# Altium schematic sheet Comparator.SchDoc
size Letter; DocumentNumber: 3; SheetNumber: 3; SheetTotal: 7
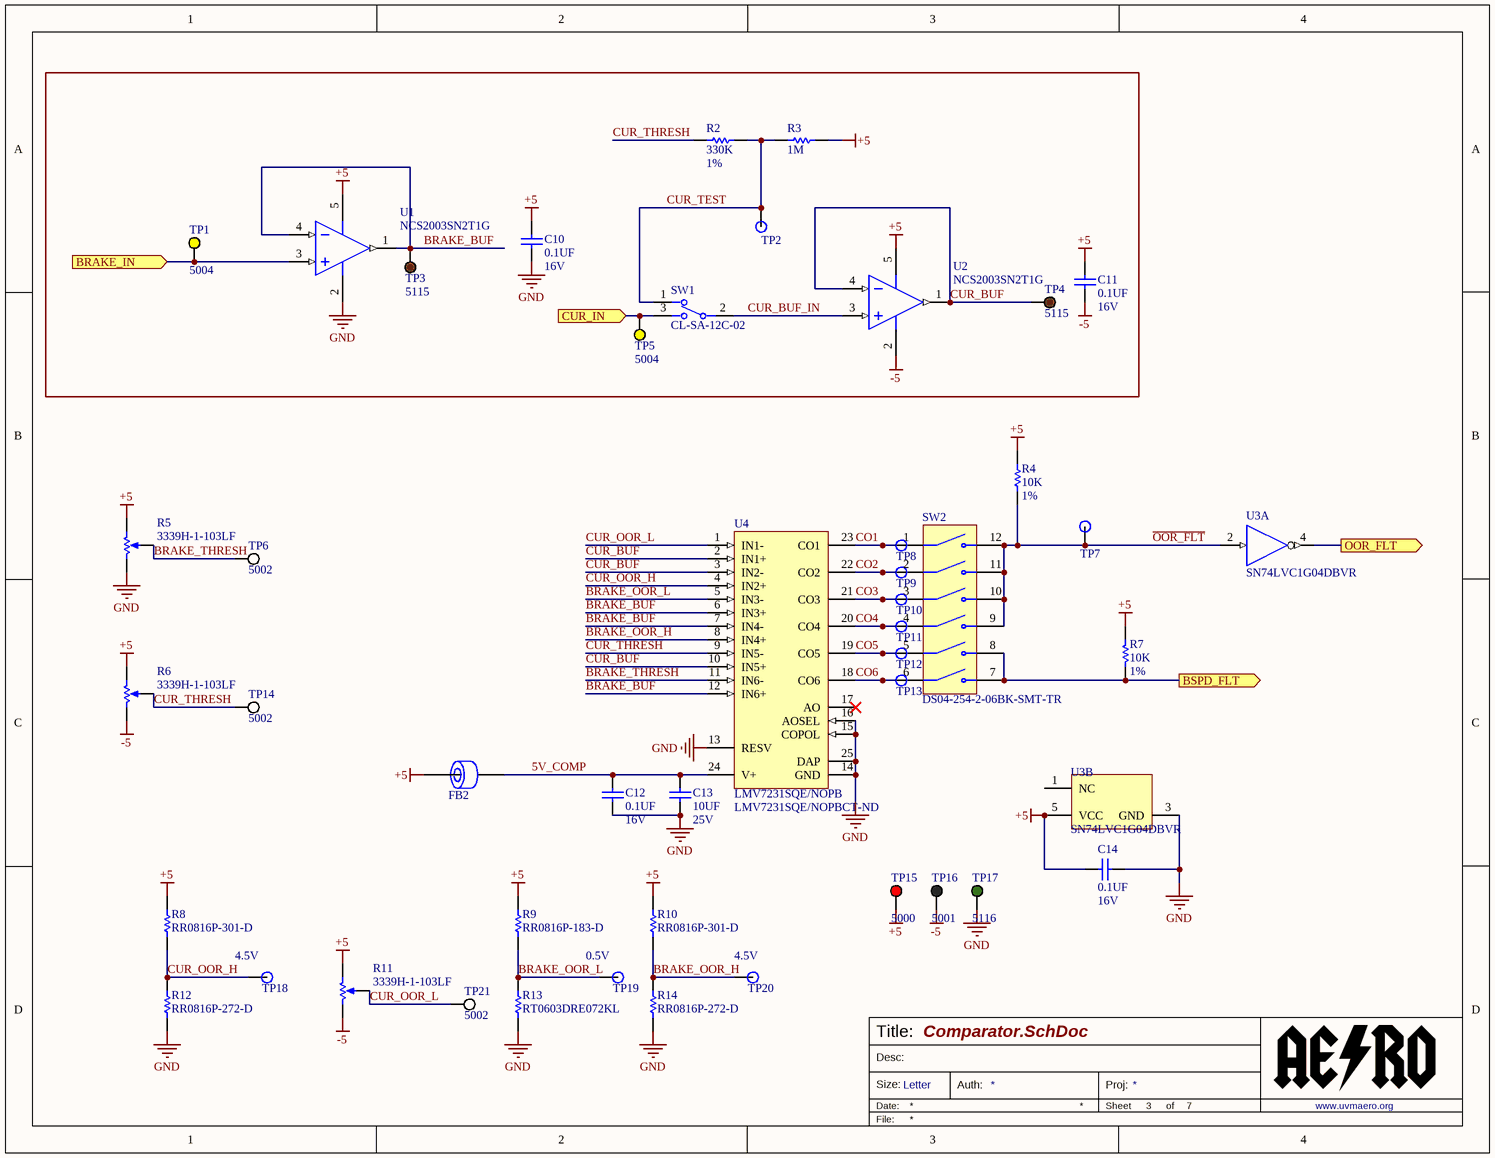
[diagram p0: Comparator.SchDoc]

## Parts
C10  Val: 0.1UF  Vol: 16V  [0603_CAP]  (hidden comment: CAP 0603 0.1UF 16V 10% X7R)
C11  Val: 0.1UF  Vol: 16V  [0603_CAP]  (hidden comment: CAP 0603 0.1UF 16V 10% X7R)
C12  Val: 0.1UF  Vol: 16V  [0603_CAP]  (hidden comment: CAP 0603 0.1UF 16V 10% X7R)
C13  Val: 10UF  Vol: 25V  [0603_CAP]  (hidden comment: CAP 0603 10UF 25V 20% X5R)
C14  Val: 0.1UF  Vol: 16V  [0603_CAP]  (hidden comment: CAP 0603 0.1UF 16V 10% X7R)
FB2  Ferrite Chip 120 Ohms  [0603]  (value not drawn)
R2  Val: 330K  Tol: 1%  [0603_RES]  (hidden comment: RES 0603 330K 1%)
R3  value 1M  [RESC2013X60X35ML10T20]  (hidden comment: RT0805BRE071ML)
R4  Val: 10K  Tol: 1%  [0603_RES]  (hidden comment: RES 0603 10K 1%)
R5  3339H-1-103LF  [3339H-1-103LF]
R6  3339H-1-103LF  [3339H-1-103LF]
R7  Val: 10K  Tol: 1%  [0603_RES]  (hidden comment: RES 0603 10K 1%)
R8  RR0816P-301-D  [RESC1608X50X30ML20T20]
R9  RR0816P-183-D  [RESC1608X50X30ML20T20]
R10  RR0816P-301-D  [RESC1608X50X30ML20T20]
R11  3339H-1-103LF  [3339H-1-103LF]
R12  RR0816P-272-D  [RESC1608X50X30NL20T20]
R13  RT0603DRE072KL  [RESC1608X55X25NL10T15]
R14  RR0816P-272-D  [RESC1608X50X30NL20T20]
SW1  CL-SA-12C-02  [CL-SA-12C-02]
SW2  DS04-254-2-06BK-SMT-TR  [*SW_DS04-254-2-06BK-SMT-TR]
TP1  5004  [KSTN-5004]
TP2  SMD Test Point  [TP_40mil]  (value not drawn)  (no BOM)
TP3  5115  [KSTN-5115]
TP4  5115  [KSTN-5115]
TP5  5004  [KSTN-5004]
TP6  5002  [KSTN-5002]
TP7  SMD Test Point  [TP_40mil]  (value not drawn)  (no BOM)
TP8  SMD Test Point  [TP_40mil]  (value not drawn)  (no BOM)
TP9  SMD Test Point  [TP_40mil]  (value not drawn)  (no BOM)
TP10  SMD Test Point  [TP_40mil]  (value not drawn)  (no BOM)
TP11  SMD Test Point  [TP_40mil]  (value not drawn)  (no BOM)
TP12  SMD Test Point  [TP_40mil]  (value not drawn)  (no BOM)
TP13  SMD Test Point  [TP_40mil]  (value not drawn)  (no BOM)
TP14  5002  [KSTN-5002]
TP15  5000  [KSTN-5000]
TP16  5001  [KSTN-5001]
TP17  5116  [KSTN-5116]
TP18  SMD Test Point  [TP_40mil]  (value not drawn)  (no BOM)
TP19  SMD Test Point  [TP_40mil]  (value not drawn)  (no BOM)
TP20  SMD Test Point  [TP_40mil]  (value not drawn)  (no BOM)
TP21  5002  [KSTN-5002]
U1  NCS2003SN2T1G  [ONSC-TSOP-5-483-02_V]
U2  NCS2003SN2T1G  [ONSC-TSOP-5-483-02_V]
U3  SN74LVC1G04DBVR  [DBV0005A_M]  (parts A,B of 2)
U4  LMV7231SQE/NOPB  Supplier Part Number 1: LMV7231SQE/NOPBCT-ND  [RTW0024A_V]

## Ports
BRAKE_IN (in), BSPD_FLT (out), CUR_IN (in), OOR_FLT (out)

## Nets
+5: C10.2 C11.2 C14.2 FB2.1 R3.2 R4.2 R5.1(CCW) R6.1(CCW) R7.1 R8.2 R9.2 R10.2 R11.1(CCW) TP15.1 U1.5(VDD) U2.5(VDD) U3.5(VCC)
-5: C11.1 R6.3(CW) R11.3(CW) TP16.1 U2.2(VSS)
GND: C10.1 C12.1 C13.1 C14.1 R5.3(CW) R12.1 R13.1 R14.1 TP17.1 U1.2(VSS) U3.3(GND) U4.13(RESV) U4.14(GND) U4.15(COPOL) U4.16(AOSEL) U4.25(DAP)
5V_COMP: C12.2 C13.2 FB2.2 U4.24(V+)
~{OOR_FLT}: R4.1 SW2.9(NO4) SW2.10(NO3) SW2.11(NO2) SW2.12(NO1) TP7.1 U3.2(A)
BRAKE_BUF: TP3.1 U1.1(VOUT) U1.4(IN-) U4.6(IN3+) U4.7(IN4-) U4.12(IN6+)
BRAKE_IN: TP1.1 U1.3(IN+) ; port BRAKE_IN
BRAKE_OOR_H: R10.1 R14.2 TP20.1 U4.8(IN4+)
BRAKE_OOR_L: R9.1 R13.2 TP19.1 U4.5(IN3-)
BRAKE_THRESH: R5.2(WIPER) TP6.1 U4.11(IN6-)
BSPD_FLT: R7.2 SW2.7(NO6) SW2.8(NO5) ; port BSPD_FLT
CO1: SW2.1(COM1) TP8.1 U4.23(CO1)
CO2: SW2.2(COM2) TP9.1 U4.22(CO2)
CO3: SW2.3(COM3) TP10.1 U4.21(CO3)
CO4: SW2.4(COM4) TP11.1 U4.20(CO4)
CO5: SW2.5(COM5) TP12.1 U4.19(CO5)
CO6: SW2.6(COM6) TP13.1 U4.18(CO6)
CUR_BUF: TP4.1 U2.1(VOUT) U2.4(IN-) U4.2(IN1+) U4.3(IN2-) U4.10(IN5+)
CUR_BUF_IN: SW1.2 U2.3(IN+)
CUR_IN: SW1.3 TP5.1 ; port CUR_IN
CUR_OOR_H: R8.1 R12.2 TP18.1 U4.4(IN2+)
CUR_OOR_L: R11.2(WIPER) TP21.1 U4.1(IN1-)
CUR_TEST: R2.2 R3.1 SW1.1 TP2.1
CUR_THRESH: R2.1 R6.2(WIPER) TP14.1 U4.9(IN5-)
OOR_FLT: U3.4(Y) ; port OOR_FLT

Not connected (* = marked no-connect by the designer): U3 1(NC); U4 17(AO)*

## Notes on the sheet
- (near TP18) 4.5V
- (near TP19) 0.5V
- (near TP20) 4.5V
- Title:
- Size:
- Date:
- Desc:
- Letter
- Auth:
- Sheet
- Proj:
- of
- www.uvmaero.org
- File:

## Library data of the parts
C10-C12 C14 = CAP 0603 0.1UF 16V 10% X7R: Capacitor Surface Mount 0603 Footprint 0.1UF 16V 10% Tolerance Ceramic X7R; Manufacturer: Various; PCB Package: 0603; Description in Visual: Cap SMT 0603 0.1UF 16V 10%  Cer X7R; P/N: CAP 0603 0.1UF 16V 10% X7R; Manufacturer P/N: Various; Value: 0.1UF; Voltage: 16V; Tolerance: 10%; Type: Ceramic X7R; ComponentLink1Description: Manufacturer Website; ComponentLink2Description: Component Datasheet; ComponentLink3Description: Octopart Link
C13 = CAP 0603 10UF 25V 20% X5R: Capacitor Surface Mount 0603 Footprint 10UF 25V 20% Tolerance Ceramic X5R; Manufacturer: Various; PCB Package: 0603; Description in Visual: Cap SMT 0603 10UF 25V 20% Ceramic X5R; P/N: CAP 0603 10UF 25V 20% X5R; Manufacturer P/N: Various; Value: 10UF; Voltage: 25V; Tolerance: 20%; Type: Ceramic X5R; ComponentLink1Description: Manufacturer Website; ComponentLink2Description: Component Datasheet; ComponentLink3Description: Octopart Link
FB2 = MMZ1608S121A: Ferrite Chip 500 mA 120 Ohms Differential Mode - Single 0603 Footprint; Manufacturer: TDK; Description in Visual: Ferrite SMT 500mA 120Ohm Dif Mode 0603; Usage: Signal Line; Current (mA): 500; Frequency: 100 MHz; Impedance at Freq (ohms): 120; DC Resistance (ohms): 0.2; P/N: MMZ1608S121A; Manufacturer P/N: MMZ1608S121A; Filter type: Differential Mode - Single; Operating Temperature Range: -55 to +125 °C; PCB Package: 0603; ComponentLink1Description: Manufacturer Website; ComponentLink1URL: http://www.tdk.com/; ComponentLink2Description: Component Datasheet; ComponentLink2URL: http://www.tdk.co.jp/tefe02/e9412_mmz1608.pdf; ComponentLink3Description: Octopart Link; ComponentLink3URL: http://octopart.com/partsearch/#search/requestData&q=MMZ1608S121A
R2 = RES 0603 330K 1%: Resistor Surface Mount, 330K Ohms, 0603 Footprint, 1% Tolerance 0.1W; Manufacturer: Various; PCB Package: 0603; Description in Visual: Res SMT 330K 0603  1%  0.1W; P/N: RES 0603 330K 1%; Manufacturer P/N: Various; Value: 330K; Power_Rating: 0.1W; Tolerance: 1%
R3 = CMP-2001-01491-1: Manufacturer: Yageo; Part Number: RT0805BRE071ML
R4 R7 = RES 0603 10K 1%: Resistor Surface Mount, 10K Ohms, 0603 Footprint, 1% Tolerance 0.1W; Manufacturer: Various; PCB Package: 0603; Description in Visual: Res SMT 10K 0603  1%  0.1W; P/N: RES 0603 10K 1%; Manufacturer P/N: Various; Value: 10K; Power_Rating: 0.1W; Tolerance: 1%
R5 R6 R11 = 3339H-1-103LF: 10 kOhms 0.5W, 1/2W PC Pins Through Hole Trimmer Potentiometer Cermet 4 Turn Top Adjustment; ComponentLink2URL: https://www.ttelectronics.com/TTElectronics/media/ProductFiles/Trimmers/Datasheets/67.pdf; ComponentLink2Description: Datasheet; Supplier 1: Digi-Key; Supplier Part Number 1: 3339H-103LF-ND
R8 R10 = CMP-2000-02599-1: Manufacturer: Susumu; Part Number: RR0816P-301-D
R9 = CMP-2000-02514-1: Manufacturer: Susumu; Part Number: RR0816P-183-D
R12 R14 = CMP-2000-02579-1: Manufacturer: Susumu; Part Number: RR0816P-272-D
R13 = CMP-2000-04621-1: Manufacturer: Yageo; Part Number: RT0603DRE072KL
SW1 = CL-SA-12C-02: Slide Switch SPDT Through Hole; Supplier 1: Digi-Key; Supplier Part Number 1: 563-1388-ND
SW2 = DS04-254-2-06BK-SMT-TR: Dip Switch SPST 6 Position Surface Mount Slide (Standard) Actuator 25mA 24VDC; Value: *; Supplier 1: Mouser; Supplier 2: Mouser; Supplier Part Number 2: 490-DS04254206BK-STR; Supplier Part Number 1: 490-DS04254206BK-STR
TP1 TP5 = 5004: Test Point, Yellow, 1-Pin THD, RoHS, Bulk; Manufacturer: KeystoneElectronics; Outside Diameter: 2.54mm; Plating: Silver; Mounting Hole Size: 1mm; Product: TestPoints; Packaging: Bulk; Manufacturer URL: http://www.keyelco.com/; Length: 7.62mm; Datasheet Version: Rev. G, 12/2008; Type: Miniature; Product Category: CircuitBoardHardware-PCB; Material: Nylon; RoHS: True; Contact Material: PhosphorBronze; Datasheet URL: https://ciiva.com/datasheet-click-2917627?src=ciiva&sig=bd195616; Color: Yellow; Brand: KeystoneElectronics; Supplier 1: Digi-Key; Supplier Part Number 1: 36-5004-ND
TP2 TP7-TP13 TP18-TP20 = TP_SMD
TP3 TP4 = 5115: Test Point, Brown, 1-Pin THD, RoHS, Bulk; Manufacturer: KeystoneElectronics; Outside Diameter: 2.54mm; Plating: Silver; Mounting Hole Size: 1mm; Product: TestPoints; Packaging: Bulk; Manufacturer URL: http://www.keyelco.com/; Length: 7.62mm; Datasheet Version: Rev. G, 12/2008; Type: Miniature; Product Category: CircuitBoardHardware-PCB; Material: Nylon; RoHS: True; Contact Material: PhosphorBronze; Datasheet URL: https://ciiva.com/datasheet-click-2917627?src=ciiva&sig=bd195616; Color: Brown; Brand: KeystoneElectronics; Supplier 1: Digi-Key; Supplier Part Number 1: 36-5115-ND
TP6 TP14 TP21 = 5002: Test Point, White, 1-Pin THD, RoHS, Bulk; Manufacturer: KeystoneElectronics; Outside Diameter: 2.54mm; Plating: Silver; Mounting Hole Size: 1mm; Product: TestPoints; Packaging: Bulk; Manufacturer URL: http://www.keyelco.com/; Length: 7.62mm; Datasheet Version: Rev. G, 12/2008; Type: Miniature; Product Category: CircuitBoardHardware-PCB; Material: Nylon; RoHS: True; Contact Material: PhosphorBronze; Datasheet URL: https://ciiva.com/datasheet-click-2917627?src=ciiva&sig=bd195616; Color: White; Brand: KeystoneElectronics; Supplier 1: Digi-Key; Supplier Part Number 1: 36-5002-ND
TP15 = 5000: Test Point, Red, 1-Pin THD, RoHS, Bulk; Manufacturer: KeystoneElectronics; Outside Diameter: 2.54mm; Plating: Silver; Mounting Hole Size: 1mm; Product: TestPoints; Packaging: Bulk; Manufacturer URL: http://www.keyelco.com/; Length: 7.62mm; Datasheet Version: Rev. G, 12/2008; Type: Miniature; Product Category: CircuitBoardHardware-PCB; Material: Nylon; RoHS: True; Contact Material: PhosphorBronze; Datasheet URL: https://ciiva.com/datasheet-click-2917627?src=ciiva&sig=bd195616; Color: Red; Brand: KeystoneElectronics; Supplier 1: Digi-Key; Supplier Part Number 1: 36-5000-ND
TP16 = 5001: Test Point, Black, 1-Pin THD, RoHS, Bulk; Manufacturer: KeystoneElectronics; Outside Diameter: 2.54mm; Plating: Silver; Mounting Hole Size: 1mm; Product: TestPoints; Packaging: Bulk; Manufacturer URL: http://www.keyelco.com/; Length: 7.62mm; Datasheet Version: Rev. G, 12/2008; Type: Miniature; Product Category: CircuitBoardHardware-PCB; Material: Nylon; RoHS: True; Contact Material: PhosphorBronze; Datasheet URL: https://ciiva.com/datasheet-click-2917627?src=ciiva&sig=bd195616; Color: Black; Brand: KeystoneElectronics; Supplier 1: Digi-Key; Supplier Part Number 1: 36-5001-ND
TP17 = 5116: Test Point, Green, 1-Pin THD, RoHS, Bulk; Manufacturer: KeystoneElectronics; Outside Diameter: 2.54mm; Plating: Silver; Mounting Hole Size: 1mm; Product: TestPoints; Packaging: Bulk; Manufacturer URL: http://www.keyelco.com/; Length: 7.62mm; Datasheet Version: Rev. G, 12/2008; Type: Miniature; Product Category: CircuitBoardHardware-PCB; Material: Nylon; RoHS: True; Contact Material: PhosphorBronze; Datasheet URL: https://ciiva.com/datasheet-click-2917627?src=ciiva&sig=bd195616; Color: Green; Brand: KeystoneElectronics; Supplier 1: Digi-Key; Supplier Part Number 1: 36-5116-ND
U1 U2 = CMP-1310-00381-1: Low Voltage, Rail-to-Rail Output Operational Amplifier, 1.7 to 5.5 V, -40 to 85 degC, 5-Pin TSOP, Pb-Free, Tape and Reel; Manufacturer: On Semiconductor; VCC Max (V): 5.5; VCC Min (V): 1.7; ComponentLink3URL: http://www.onsemi.com/pub_link/Collateral/483.PDF; Packing: Tape and Reel; ComponentLink1URL: http://www.onsemi.com/; PackageReference: TSOP-5-483-02; Mounting Technology: Surface Mount; PackageVersion: Rev. K, 04/2013; PartNumber: NCS2003SN2T1G; DatasheetVersion: Rev. 3; ComponentLink2URL: http://www.onsemi.cn/pub_link/Collateral/NCS2003-D.PDF; ComponentLink2Description: Datasheet; ComponentLink3Description: Package Specification; RoHS: TRUE; PackageDescription: 5-Pin Small Outline Package, Body 3 x 1.5 mm, Pitch 0.95 mm; ComponentLink1Description: Manufacturer URL
U3 = CMP-0859-00134-3: Single Inverter, DBV0005A, LARGE T&R; Manufacturer: Texas Instruments; 3-State Output: No; Sub-Family: Inverting Buffer/Driver; Logic: Inverting; Rating: Catalog; VCC(Max)(V): 5.5; ICC @ Nom Voltage(Max)(mA): 0.01; Output Type: CMOS; Output Drive (IOL/IOH)(Max)(mA): 32/-32; tpd @ Nom Voltage(Max)(ns): 7.5,5.2,4.2,3.7; Technology Family: LVC; Input Type: CMOS/TTL; Bits(#): 1; F @ Nom Voltage(Max)(Mhz): 150; VCC(Min)(V): 1.65; Voltage(Nom)(V): 1.8,2.5,3.3,5; DatasheetVersion: SCES214AD; Schmitt Trigger: No; Operating Temperature Range(C): -40 to 125,-40 to 85; PackageReference: DBV0005A; Generic Part Number: SN74LVC1G04
U4 = LMV7231SQE/NOPB: Hex Window Comparator with 1.5% Precision and 400mV Reference, 24-pin LLP, 250 Reel; Manufacturer: Texas Instruments; PowerWise: N; PackageTopMarking: NS*UZXYTT*L7231SQ; Code_JEDEC: MO-220-WGGD-6; PinCount: 24; ComponentLink1Description: Datasheet URL; PackageDescription: LLP, Plastic, Quad, 4 x 4 x 0.8mm Body, 24 Lead, 0.5mm Pitch, No Pullback; PackageReference: RTW0024A; CompType: Comparator; RoHS: Y; ComponentLink1URL: http://www.ti.com/general/docs/lit/getliterature.tsp?genericPartNumber=LMV7231&fileType=pdf; Supplier 1: Digi-Key